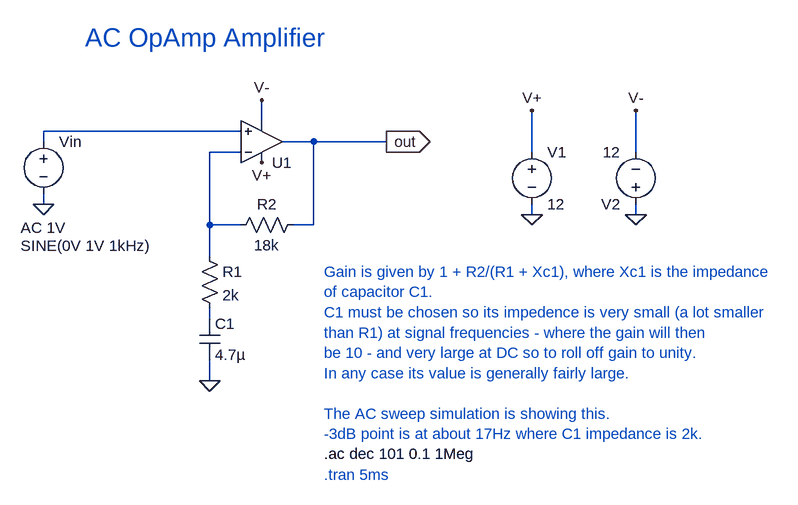
[diagram p0: schematic Figure4.7.asc]
Figure4.7.asc, the LTspice schematic file:
Version 4
SHEET 1 1092 680
WIRE 160 112 160 80
WIRE 128 128 -176 128
WIRE -176 144 -176 128
WIRE 240 144 192 144
WIRE 352 144 240 144
WIRE 128 160 80 160
WIRE 576 160 576 96
WIRE 736 160 736 96
WIRE -176 240 -176 224
WIRE 576 256 576 240
WIRE 736 256 736 240
WIRE 80 272 80 160
WIRE 128 272 80 272
WIRE 240 272 240 144
WIRE 240 272 208 272
WIRE 80 320 80 272
WIRE 80 416 80 400
WIRE 80 512 80 480
FLAG 80 512 0
FLAG 352 144 out
IOPIN 352 144 Out
FLAG 576 256 0
FLAG 576 96 V+
FLAG 736 256 0
FLAG 736 96 V-
FLAG 160 176 V+
FLAG 160 80 V-
FLAG -176 240 0
SYMBOL res 64 304 R0
SYMATTR InstName R1
SYMATTR Value 2k
SYMBOL res 224 256 R90
WINDOW 0 0 56 VBottom 2
WINDOW 3 32 56 VTop 2
SYMATTR InstName R2
SYMATTR Value 18k
SYMBOL voltage 576 144 R0
WINDOW 123 0 0 Left 0
WINDOW 39 0 0 Left 0
SYMATTR InstName V1
SYMATTR Value 12
SYMBOL voltage 736 256 R180
WINDOW 123 0 0 Left 0
WINDOW 39 0 0 Left 0
SYMATTR InstName V2
SYMATTR Value 12
SYMBOL OpAmps\\UniversalOpamp2 160 144 M180
SYMATTR InstName U1
SYMBOL voltage -176 128 R0
WINDOW 3 -35 176 Left 2
WINDOW 123 -35 148 Left 2
WINDOW 39 0 0 Left 0
SYMATTR Value SINE(0V 1V 1kHz)
SYMATTR Value2 AC 1V
SYMATTR InstName Vin
SYMBOL cap 64 416 R0
SYMATTR InstName C1
SYMATTR Value 4.7µ
TEXT 256 624 Left 2 !.ac dec 101 0.1 1Meg
TEXT 256 344 Left 2 ;Gain is given by 1 + R2/(R1 + Xc1), where Xc1 is the impedance \nof capacitor C1.\nC1 must be chosen so its impedence is very small (a lot smaller \nthan R1) at signal frequencies - where the gain will then \nbe 10 - and very large at DC so to roll off gain to unity.\nIn any case its value is generally fairly large.\n \nThe AC sweep simulation is showing this. \n-3dB point is at about 17Hz where C1 impedance is 2k.
TEXT -112 -16 Left 4 ;AC OpAmp Amplifier
TEXT 256 656 Left 2 ;.tran 5ms

The netlist it stands for:
* Figure4.7.asc
R1 N002 N003 2k
R2 out N002 18k
V1 V+ 0 12
V2 0 V- 12
XU1 N001 N002 V+ V- out level.2 Avol=1Meg GBW=10Meg Slew=10Meg ilimit=25m rail=0 Vos=0 phimargin=45 en=0 enk=0 in=0 ink=0 Rin=500Meg  ; pins IN+ IN- V+ V- OUT
Vin N001 0 SINE(0V 1V 1kHz) AC 1V
C1 N003 0 4.7µ
.ac dec 101 0.1 1Meg
* Gain is given by 1 + R2/(R1 + Xc1), where Xc1 is the impedance
* of capacitor C1.
* C1 must be chosen so its impedence is very small (a lot smaller
* than R1) at signal frequencies - where the gain will then
* be 10 - and very large at DC so to roll off gain to unity.
* In any case its value is generally fairly large.
* The AC sweep simulation is showing this.
* -3dB point is at about 17Hz where C1 impedance is 2k.
* AC OpAmp Amplifier
* .tran 5ms
.lib UniversalOpamps2.sub
.backanno
.end